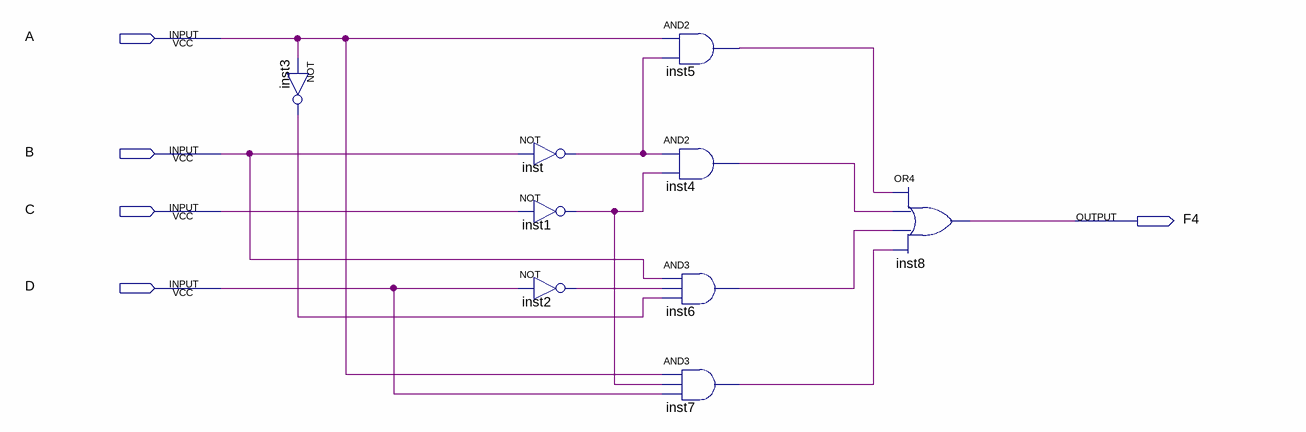
[diagram p0: schematic sheet]
// Quartus schematic LAB02_Cau6.bdf as structural Verilog: 9 symbols, 5 pins
module LAB02_Cau6 (
  input  A,
  input  B,
  input  C,
  input  D,
  output F4
);

  wire inst1_out, inst2_out, inst3_out, inst4_out, inst5_out, inst6_out, inst7_out, inst_out;

  not inst3 (inst3_out, A);
  not inst (inst_out, B);
  not inst1 (inst1_out, C);
  not inst2 (inst2_out, D);
  and inst5 (inst5_out, A, inst_out);
  and inst4 (inst4_out, inst_out, inst1_out);
  and inst6 (inst6_out, B, inst2_out, inst3_out);
  and inst7 (inst7_out, A, inst1_out, D);
  or inst8 (F4, inst5_out, inst4_out, inst6_out, inst7_out);
endmodule
